# EAGLE design RPMSensor (EAGLE 4.16)
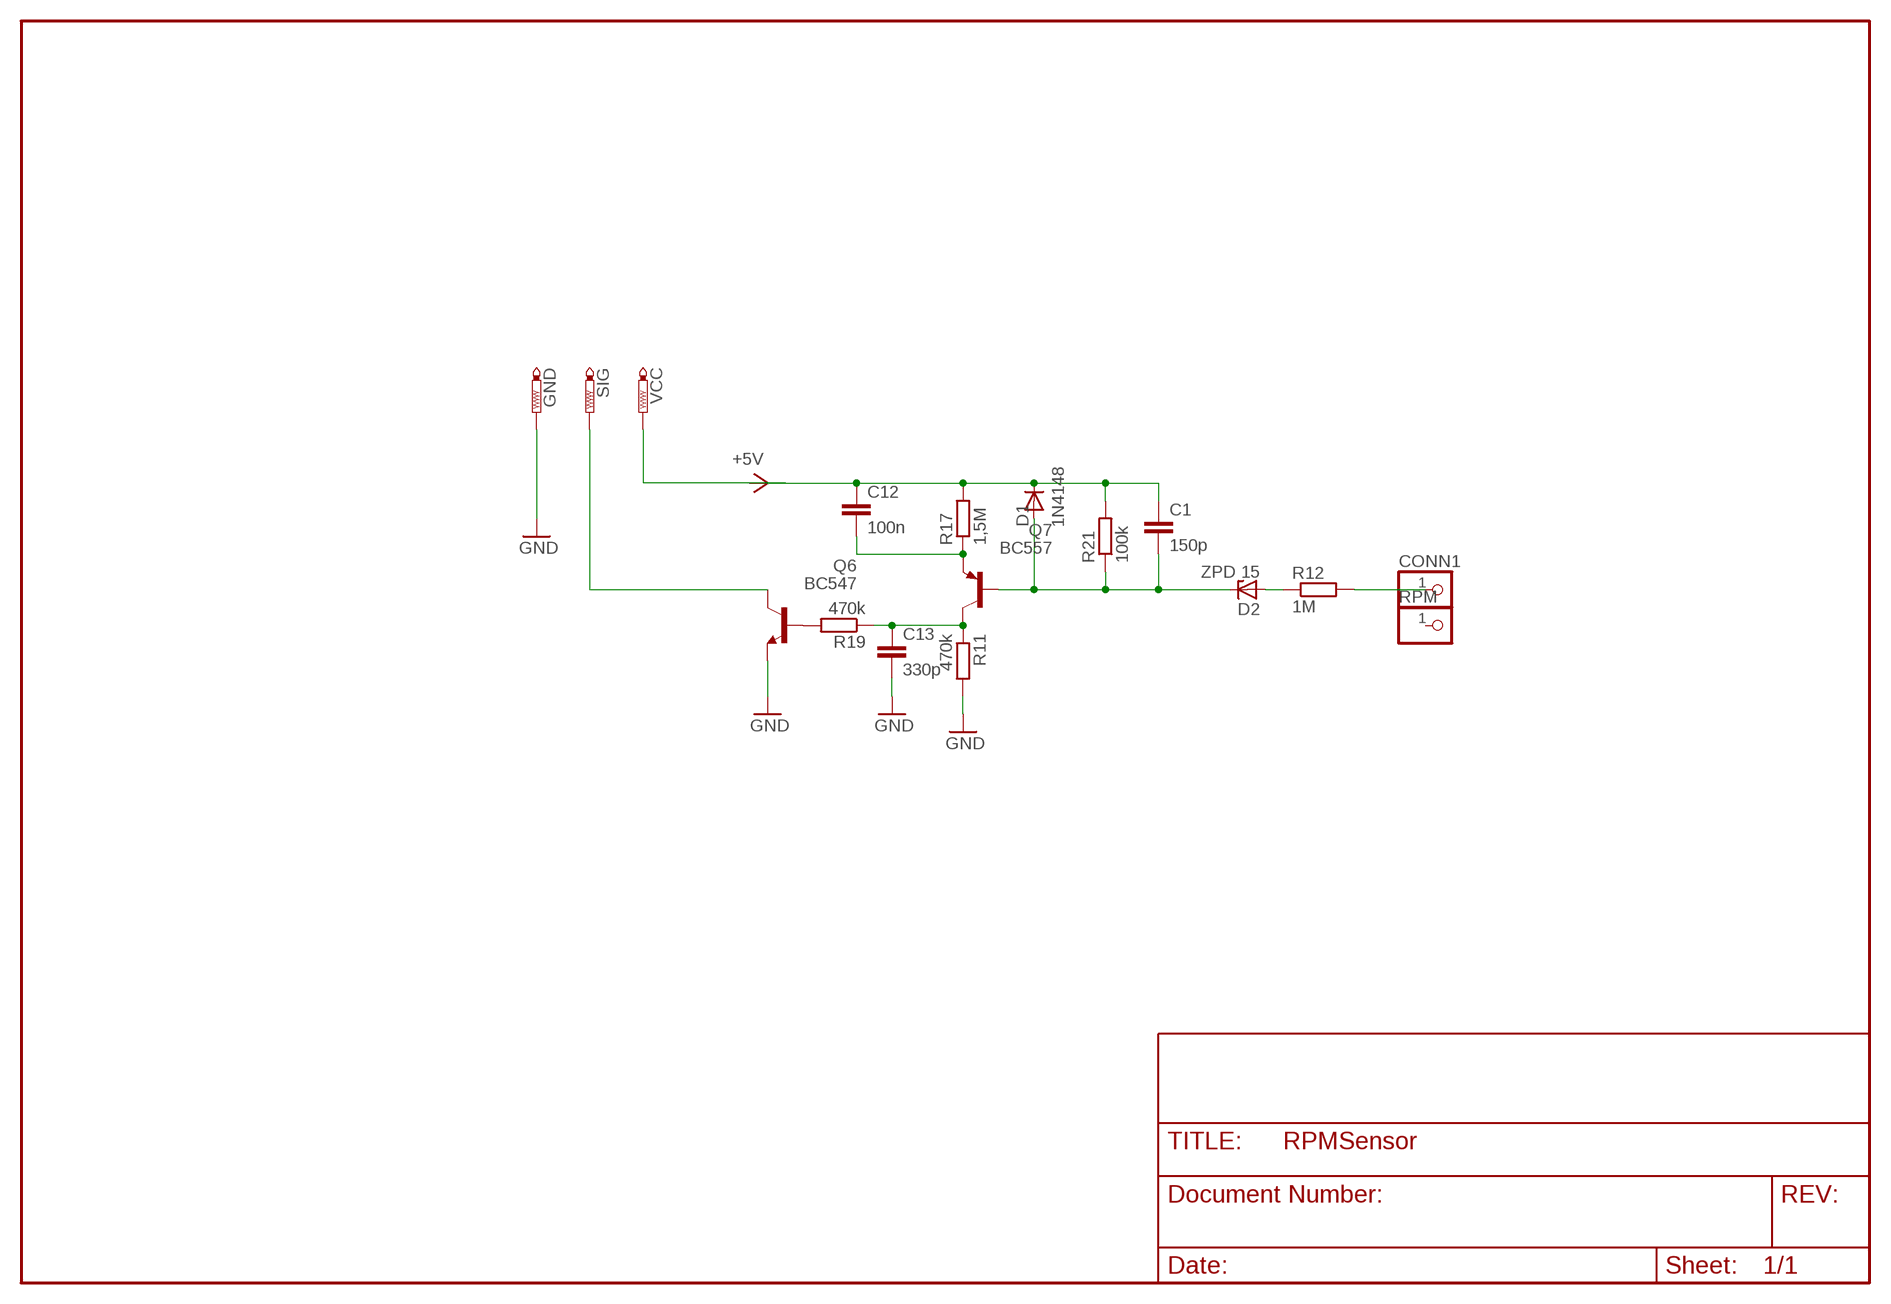
[diagram p0: schematic, sheet 1]

## Parts
C1  150p  C-EU025-025X050  [C025-025X050]
C12  100n  C-EU025-025X050  [C025-025X050]
C13  330p  C-EU025-025X050  [C025-025X050]
CONN1  PINHD-1X1  [1X01]
D1  1N4148  [DO35-10]
D2  ZPD 15  ZPD  [DO35Z10]
GND  PTR1PAD1-17Y  [P1-17Y]
Q6  BC547  [TO92]
Q7  BC557  [TO92]
R11  470k  R-EU_0207/10  [0207/10]
R12  1M  R-EU_0207/10  [0207/10]
R17  1,5M  R-EU_0207/10  [0207/10]
R19  470k  R-EU_0207/10  [0207/10]
R21  100k  R-EU_0207/10  [0207/10]
RPM  PINHD-1X1  [1X01]
SIG  PTR1PAD1-17Y  [P1-17Y]
VCC  PTR1PAD1-17Y  [P1-17Y]

## Nets
GND [power]: C13.2 GND.1(TP) Q6.1(E) R11.2
N$1: D2.A R12.1
N$2: C1.1 C12.1 D1.C R17.2 R21.2 VCC.1(TP)
N$15: Q6.2(B) R19.2
N$40: C13.1 Q7.3(C) R11.1 R19.1
N$41: Q6.3(C) SIG.1(TP)
N$43: CONN1.1 R12.2
N$45: C12.2 Q7.1(E) R17.1
N$47: C1.2 D1.A D2.C Q7.2(B) R21.1
Unconnected: RPM.1

## Library data of the parts
C1 C12 C13 = rcl:C-EU: CAPACITOR, European symbol
CONN1 RPM = pinhead:PINHD-1X1: PIN HEADER
D1 = diode:1N4148: DIODE high speed (Philips)
D2 = diode:ZPD: Z DIODE 500 mW
GND SIG VCC = testpad:PTR1: TEST PIN
Q6 = transistor-npn:BC547*: NPN Transistor
Q7 = transistor-pnp:BC557: PNP Transistor
R11 R12 R17 R19 R21 = rcl:R-EU_: RESISTOR, European symbol

## Net classes
0 default: width 0.3 mm, drill 0.2 mm, clearance 0.6 mm
1 power: width 0.4 mm, drill 0.2 mm, clearance 0.6 mm

## Board
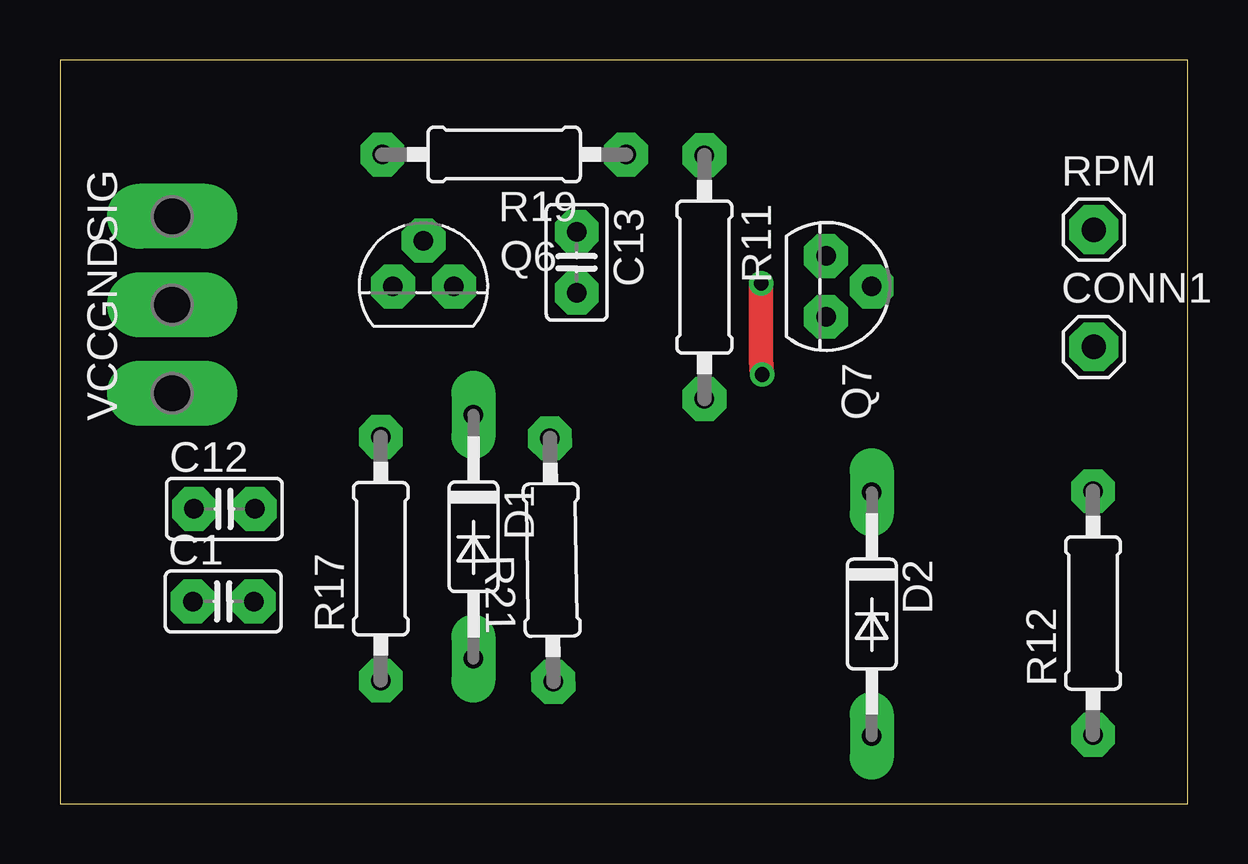
[diagram p1: board, top side]
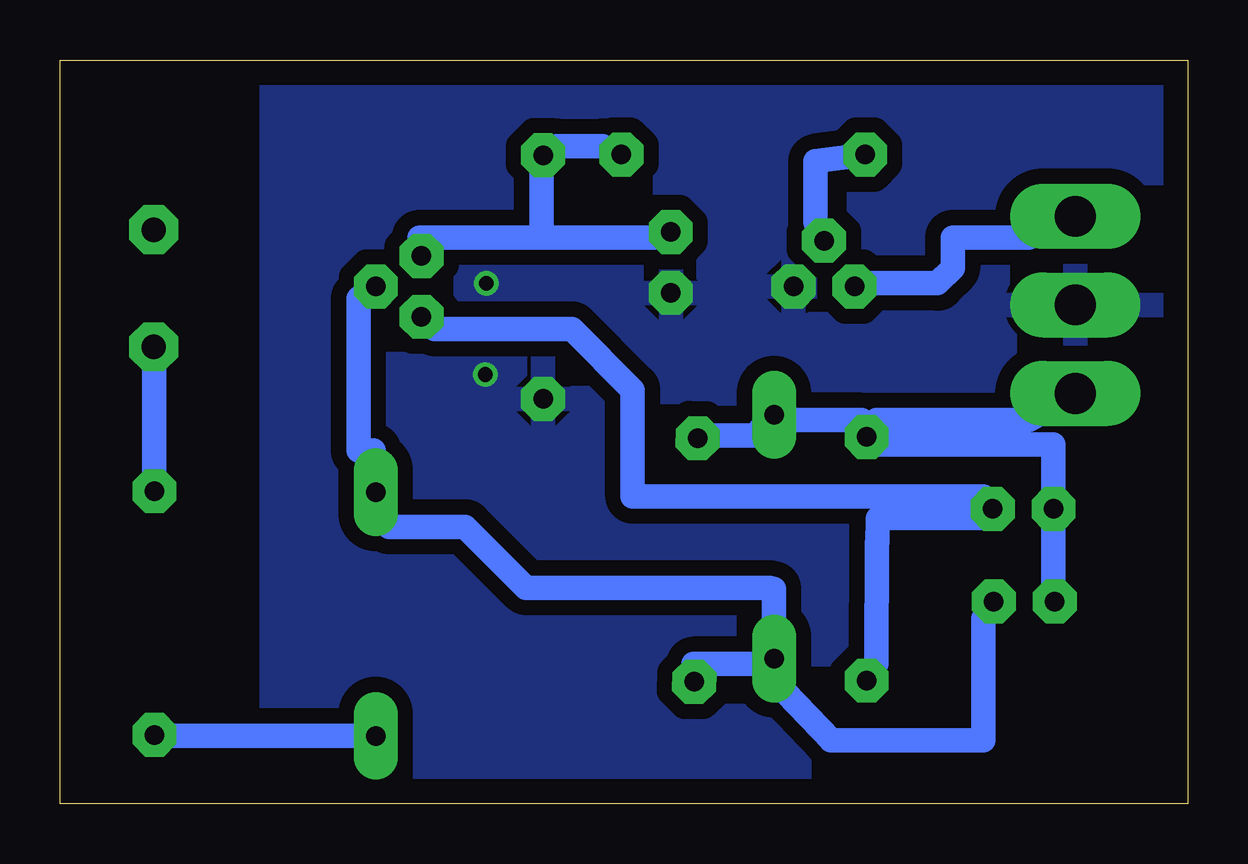
[diagram p2: board, bottom side, seen from below]

Size 47 x 31 mm. Coordinates in mm from the lower left corner, seen from the top.
Outline: 0,0 47,0 47,31 0,31 0,0
Copper layers (1*16): Top 0.035mm / dielectric 2.5mm / Bottom 0.035mm
Design rules "default": minimum track width 40mil, minimum drill 24mil, track to track 25mil, track to pad 25mil, pad to pad 25mil, via to via 25mil, smd to smd 25mil, copper to edge 40mil, drill to drill 8mil, minimum pad ring 10mil, minimum via ring 8mil, stop-mask expansion 4mil, vias tented up to drill 0mil, thermal gap 10mil

### Footprints (pad centres in the part's own frame; a part is rotated, then mirrored left to right if it is on the bottom)
C025-025X050 = drill 0.813 octagon: 1 -1.27,0; 2 1.27,0
1X01 = drill 1.016 octagon: 1 0,0
DO35-10 = drill 0.813 long: A 5.08,0; C -5.08,0
DO35Z10 = drill 0.813 long: A 5.08,0; C -5.08,0
P1-17Y = drill 1.702 pad 2.121 long: 1 0,0
TO92 = drill 0.813 octagon: 1 1.27,0; 2 0,1.905; 3 -1.27,0
0207/10 = drill 0.813 octagon: 1 -5.08,0; 2 5.08,0

### Placement (x,y rotation side)
C1  6.8,8.42 0 top
C12  6.85,12.29 0 top
C13  21.54,22.56 270 top
CONN1  43.09,19.04 0 top
D1  17.24,11.12 270 top
D2  33.84,7.9 270 top
GND  4.68,20.79 90 top
Q6  15.15,21.56 0 top
Q7  31.93,21.56 270 top
R11  26.86,21.95 270 top
R12  43.06,7.94 90 top
R17  13.37,10.21 90 top
R19  18.52,27.06 180 top
R21  20.49,10.15 90.8 top
RPM  43.09,23.92 0 top
SIG  4.68,24.48 90 top
VCC  4.68,17.1 90 top

### Tracks (layer width: path | path; a pad name or v marks a point on that pad's centre or on a via)
GND  (via drill 0.61)
  Top 1.016: v29.27,17.88 29.23,18.52 v29.23,21.7
  pour Bottom: 0.95,0.94 38.17,0.94 38.18,30.06 0.91,30.08
N$1
  Bottom 1.016: D2.A 34.55,2.83 42.81,2.83 R12.1
N$2
  Bottom 1.016: R17.2 13.6,15.98 16.77,15.98 D1.C 18.04,15.35 19.95,15.35 R21.2 | R17.2 12.97,14.96 5.58,14.96 5.58,12.81 C12.1 5.58,11.46 5.58,8.92 C1.1 | VCC.1 6.62,15.98 12.97,15.98 R17.2
N$15
  Bottom 1.016: Q6.2 15.51,24.23 15.51,26.77 R19.2
N$40
  Bottom 1.016: R19.1 24.39,27.41 26.3,27.41 R11.1 26.93,26.14 26.93,23.6 | 26.93,23.6 32.02,23.6 Q7.3 | 26.93,23.6 21.86,23.6 C13.1
N$41
  Bottom 1.016: Q6.3 13.6,21.7 10.43,21.7 9.79,22.33 9.79,23.6 6.62,23.6 SIG.1
N$43
  Bottom 1.016: R12.2 43.08,13.44 43.08,18.52 CONN1.1
N$45
  Bottom 1.016: R17.1 12.97,5.82 12.95,10.88 12.92,10.88 12.91,11.89 8.47,11.91 C12.2 8.52,12.81 23.12,12.81 23.12,17.25 25.66,19.79 31.38,19.79 Q7.1
N$47
  Bottom 1.016: D1.A 17.24,8.95 | C1.2 8.52,7.73 8.52,2.64 14.87,2.64 14.85,2.63 17.24,5.14 17.25,6.02 D1.A | R21.1 20.58,5.82 18.04,5.82 D1.A | Q7.2 34.55,21.06 34.55,14.71 33.92,14.71 D2.C 33.29,11.54 30.11,11.54 27.57,9 17.41,9 17.24,8.95 D1.A